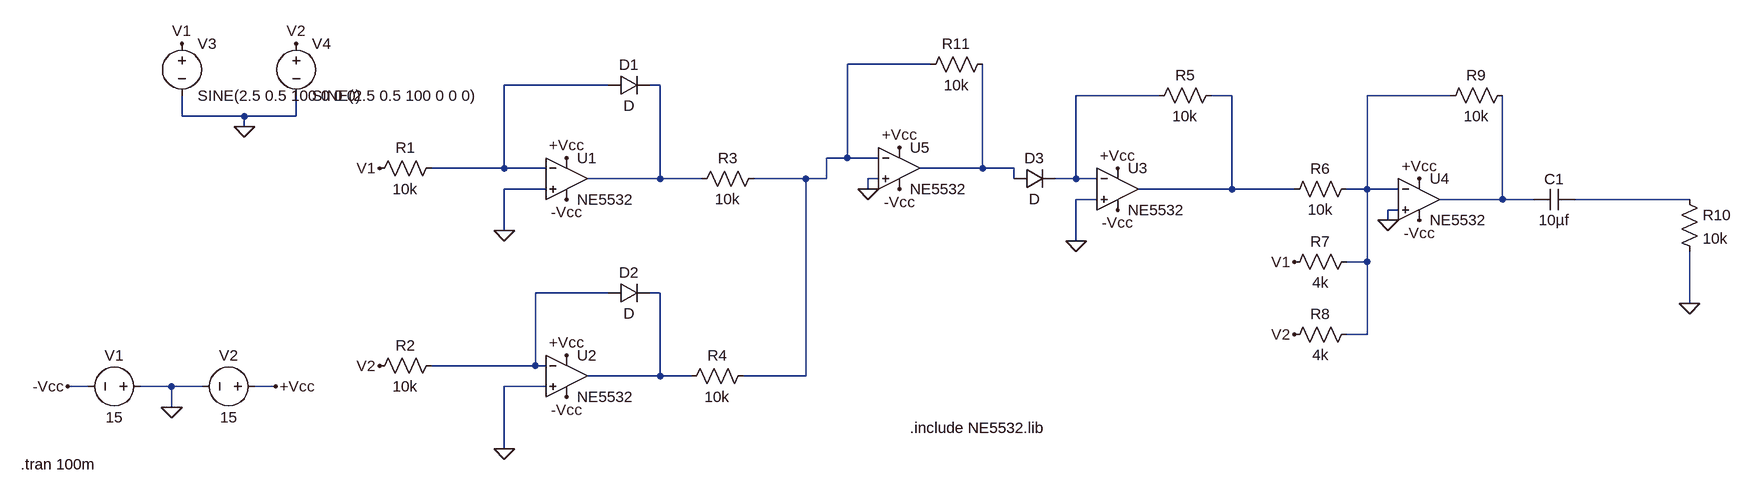
[diagram p0: schematic Multiplier.asc]
Multiplier.asc, the LTspice schematic file:
Version 4.1
SHEET 1 2036 680
WIRE 800 32 672 32
WIRE 304 64 144 64
WIRE 384 64 368 64
WIRE 1152 80 1024 80
WIRE 1264 80 1232 80
WIRE 1600 80 1472 80
WIRE -352 112 -352 80
WIRE -256 112 -352 112
WIRE -176 112 -176 80
WIRE -176 112 -256 112
WIRE -256 128 -256 112
WIRE 672 176 672 32
WIRE 672 176 640 176
WIRE 720 176 672 176
WIRE 144 192 144 64
WIRE 144 192 32 192
WIRE 208 192 144 192
WIRE 880 192 880 32
WIRE 880 192 784 192
WIRE 928 192 880 192
WIRE 384 208 384 64
WIRE 384 208 272 208
WIRE 448 208 384 208
WIRE 608 208 528 208
WIRE 640 208 640 176
WIRE 640 208 608 208
WIRE 720 208 704 208
WIRE 928 208 928 192
WIRE 1024 208 1024 80
WIRE 1024 208 992 208
WIRE 1056 208 1024 208
WIRE 208 224 144 224
WIRE 704 224 704 208
WIRE 1264 224 1264 80
WIRE 1264 224 1120 224
WIRE 1360 224 1264 224
WIRE 1472 224 1472 80
WIRE 1472 224 1440 224
WIRE 1520 224 1472 224
WIRE 1056 240 1024 240
WIRE 1680 240 1680 80
WIRE 1680 240 1584 240
WIRE 1728 240 1680 240
WIRE 1968 240 1792 240
WIRE 1520 256 1504 256
WIRE 1504 272 1504 256
WIRE 144 288 144 224
WIRE 1024 304 1024 240
WIRE 1472 336 1472 224
WIRE 1472 336 1440 336
WIRE 304 384 192 384
WIRE 384 384 368 384
WIRE 1968 400 1968 320
WIRE 1472 448 1472 336
WIRE 1472 448 1440 448
WIRE 192 496 192 384
WIRE 192 496 32 496
WIRE 208 496 192 496
WIRE 384 512 384 384
WIRE 384 512 272 512
WIRE 432 512 384 512
WIRE 608 512 608 208
WIRE 608 512 512 512
WIRE -496 528 -528 528
WIRE -368 528 -416 528
WIRE -320 528 -368 528
WIRE -208 528 -240 528
WIRE 208 528 144 528
WIRE -368 560 -368 528
WIRE 144 624 144 528
FLAG 144 288 0
FLAG 144 624 0
FLAG -368 560 0
FLAG 1024 304 0
FLAG -48 192 V1
FLAG 1360 336 V1
FLAG -48 496 V2
FLAG 1360 448 V2
FLAG -528 528 -Vcc
FLAG -208 528 +Vcc
FLAG 1088 256 -Vcc
FLAG 240 544 -Vcc
FLAG 240 240 -Vcc
FLAG 1552 272 -Vcc
FLAG 240 176 +Vcc
FLAG 1088 192 +Vcc
FLAG 1552 208 +Vcc
FLAG 240 480 +Vcc
FLAG -256 128 0
FLAG -352 0 V1
FLAG -176 0 V2
FLAG 1504 272 0
FLAG 1968 400 0
FLAG 752 224 -Vcc
FLAG 752 160 +Vcc
FLAG 704 224 0
SYMBOL OpAmps\\opamp2 240 144 R0
SYMATTR InstName U1
SYMATTR Value NE5532
SYMBOL OpAmps\\opamp2 240 448 R0
SYMATTR InstName U2
SYMATTR Value NE5532
SYMBOL res 48 176 R90
WINDOW 0 0 56 VBottom 2
WINDOW 3 32 56 VTop 2
SYMATTR InstName R1
SYMATTR Value 10k
SYMBOL res 48 480 R90
WINDOW 0 0 56 VBottom 2
WINDOW 3 32 56 VTop 2
SYMATTR InstName R2
SYMATTR Value 10k
SYMBOL res 544 192 R90
WINDOW 0 0 56 VBottom 2
WINDOW 3 32 56 VTop 2
SYMATTR InstName R3
SYMATTR Value 10k
SYMBOL diode 304 80 R270
WINDOW 0 32 32 VTop 2
WINDOW 3 0 32 VBottom 2
SYMATTR InstName D1
SYMBOL diode 304 400 R270
WINDOW 0 32 32 VTop 2
WINDOW 3 0 32 VBottom 2
SYMATTR InstName D2
SYMBOL voltage -400 528 R90
WINDOW 0 -32 56 VBottom 2
WINDOW 3 32 56 VTop 2
WINDOW 123 0 0 Left 0
WINDOW 39 0 0 Left 0
SYMATTR InstName V1
SYMATTR Value 15
SYMBOL voltage -224 528 R90
WINDOW 0 -32 56 VBottom 2
WINDOW 3 32 56 VTop 2
WINDOW 123 0 0 Left 0
WINDOW 39 0 0 Left 0
SYMATTR InstName V2
SYMATTR Value 15
SYMBOL OpAmps\\opamp2 1088 160 R0
SYMATTR InstName U3
SYMATTR Value NE5532
SYMBOL res 1248 64 R90
WINDOW 0 0 56 VBottom 2
WINDOW 3 32 56 VTop 2
SYMATTR InstName R5
SYMATTR Value 10k
SYMBOL res 1456 208 R90
WINDOW 0 0 56 VBottom 2
WINDOW 3 32 56 VTop 2
SYMATTR InstName R6
SYMATTR Value 10k
SYMBOL res 1456 320 R90
WINDOW 0 0 56 VBottom 2
WINDOW 3 32 56 VTop 2
SYMATTR InstName R7
SYMATTR Value 4k
SYMBOL res 1456 432 R90
WINDOW 0 0 56 VBottom 2
WINDOW 3 32 56 VTop 2
SYMATTR InstName R8
SYMATTR Value 4k
SYMBOL res 1696 64 R90
WINDOW 0 0 56 VBottom 2
WINDOW 3 32 56 VTop 2
SYMATTR InstName R9
SYMATTR Value 10k
SYMBOL OpAmps\\opamp2 1552 176 R0
SYMATTR InstName U4
SYMATTR Value NE5532
SYMBOL diode 928 224 R270
WINDOW 0 32 32 VTop 2
WINDOW 3 0 32 VBottom 2
SYMATTR InstName D3
SYMBOL voltage -352 -16 R0
WINDOW 123 0 0 Left 0
WINDOW 39 0 0 Left 0
SYMATTR InstName V3
SYMATTR Value SINE(2.5 0.5 100 0 0 0)
SYMBOL voltage -176 -16 R0
WINDOW 123 0 0 Left 0
WINDOW 39 0 0 Left 0
SYMATTR InstName V4
SYMATTR Value SINE(2.5 0.5 100 0 0 0)
SYMBOL cap 1792 224 R90
WINDOW 0 0 32 VBottom 2
WINDOW 3 32 32 VTop 2
SYMATTR InstName C1
SYMATTR Value 10µf
SYMBOL res 1952 224 R0
SYMATTR InstName R10
SYMATTR Value 10k
SYMBOL res 896 16 R90
WINDOW 0 0 56 VBottom 2
WINDOW 3 32 56 VTop 2
SYMATTR InstName R11
SYMATTR Value 10k
SYMBOL OpAmps\\opamp2 752 128 R0
SYMATTR InstName U5
SYMATTR Value NE5532
SYMBOL res 528 496 R90
WINDOW 0 0 56 VBottom 2
WINDOW 3 32 56 VTop 2
SYMATTR InstName R4
SYMATTR Value 10k
TEXT -600 648 Left 2 !.tran 100m
TEXT 768 592 Left 2 !.include NE5532.lib

The netlist it stands for:
* Multiplier.asc
X§U1 0 N002 +Vcc -Vcc N003 NE5532  ; pins In+ In- V+ V- OUT
X§U2 0 N010 +Vcc -Vcc N011 NE5532  ; pins In+ In- V+ V- OUT
R1 N002 V1 10k
R2 N010 V2 10k
R3 N001 N003 10k
D1 N002 N003 D
D2 N010 N011 D
V1 0 -Vcc 15
V2 +Vcc 0 15
X§U3 0 N004 +Vcc -Vcc N005 NE5532  ; pins In+ In- V+ V- OUT
R5 N005 N004 10k
R6 N006 N005 10k
R7 N006 V1 4k
R8 N006 V2 4k
R9 N008 N006 10k
X§U4 0 N006 +Vcc -Vcc N008 NE5532  ; pins In+ In- V+ V- OUT
D3 N007 N004 D
V3 V1 0 SINE(2.5 0.5 100 0 0 0)
V4 V2 0 SINE(2.5 0.5 100 0 0 0)
C1 N009 N008 10µf
R10 N009 0 10k
R11 N007 N001 10k
X§U5 0 N001 +Vcc -Vcc N007 NE5532  ; pins In+ In- V+ V- OUT
R4 N001 N011 10k
.model D D
.lib standard.dio
.tran 100m
.include NE5532.lib
.backanno
.end